# Altium schematic sheet HIGHSPEED_v0_SF2_unused.SchDoc
size B
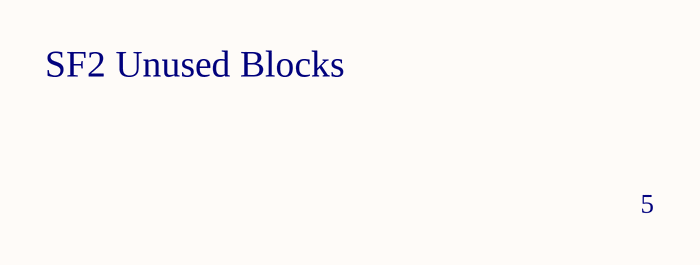
[diagram p0: HIGHSPEED_v0_SF2_unused.SchDoc]

## Notes on the sheet
- SF2 Unused Blocks
- 5